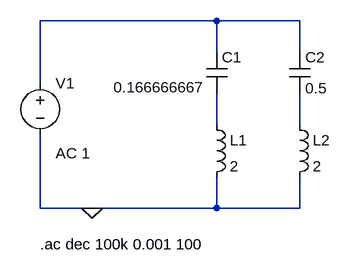
[diagram p0: schematic 1-Foster.asc]
1-Foster.asc, the LTspice schematic file:
Version 4
SHEET 1 880 680
WIRE 272 112 0 112
WIRE 400 112 272 112
WIRE 272 160 272 112
WIRE 400 160 400 112
WIRE 0 208 0 112
WIRE 272 272 272 224
WIRE 400 272 400 224
WIRE 0 400 0 288
WIRE 80 400 0 400
WIRE 272 400 272 352
WIRE 272 400 80 400
WIRE 400 400 400 352
WIRE 400 400 272 400
FLAG 80 400 0
SYMBOL cap 256 160 R0
WINDOW 3 -143 54 Left 2
SYMATTR InstName C1
SYMATTR Value 0.166666667
SYMBOL cap 384 160 R0
SYMATTR InstName C2
SYMATTR Value 0.5
SYMBOL ind 256 256 R0
SYMATTR InstName L1
SYMATTR Value 2
SYMBOL ind 384 256 R0
SYMATTR InstName L2
SYMATTR Value 2
SYMBOL voltage 0 192 R0
WINDOW 123 24 124 Left 2
WINDOW 39 0 0 Left 0
SYMATTR Value2 AC 1
SYMATTR InstName V1
SYMATTR Value ""
TEXT 0 456 Left 2 !.ac dec 100k 0.001 100

The netlist it stands for:
* 1-Foster.asc
C1 N001 N002 0.166666667
C2 N001 N003 0.5
L1 N002 0 2
L2 N003 0 2
V1 N001 0 AC 1
.ac dec 100k 0.001 100
.backanno
.end